# EAGLE schematic MAX11609EEE-Breakout-Board (EAGLE 6.5.0)
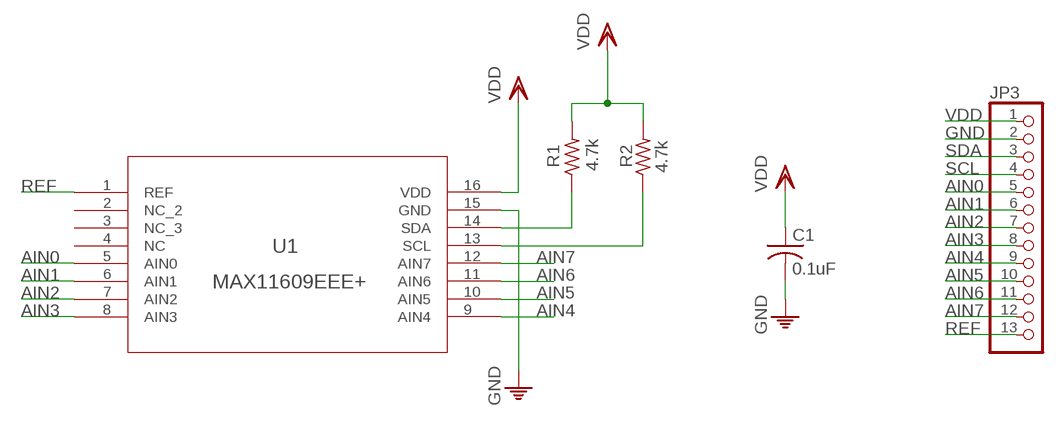
[diagram p0: schematic, sheet 1]

## Parts
C1  0.1uF  C-USC0805  [C0805]
JP3  PINHD-1X13  [1X13]
R1  4.7k  R-US_R0805  [R0805]
R2  4.7k  R-US_R0805  [R0805]
U1  MAX11609EEE+  [21-0055H_16]

## Nets
AIN0: JP3.5 U1.5(AIN0)
AIN1: JP3.6 U1.6(AIN1)
AIN2: JP3.7 U1.7(AIN2)
AIN3: JP3.8 U1.8(AIN3)
AIN4: JP3.9 U1.9(AIN4)
AIN5: JP3.10 U1.10(AIN5)
AIN6: JP3.11 U1.11(AIN6)
AIN7: JP3.12 U1.12(AIN7)
GND: C1.2 JP3.2 U1.15(GND)
REF: JP3.13 U1.1(REF)
SCL: JP3.4 R2.1 U1.13(SCL)
SDA: JP3.3 R1.1 U1.14(SDA)
VDD: C1.1 JP3.1 R1.2 R2.2 U1.16(VDD)
Unconnected: U1.2(NC_2) U1.3(NC_3) U1.4(NC)

## Library data of the parts
C1 = resistor:C-US: CAPACITOR, American symbol
JP3 = pinhead:PINHD-1X13: PIN HEADER
R1 R2 = resistor:R-US_: RESISTOR, American symbol
U1 = MAX11609EEE:MAX11609EEE+; MANUFACTURER_NAME: Maxim; MANUFACTURER_PART_NUMBER: MAX11609EEE+; VENDOR: Maxim